# EAGLE design MJ808 clone - all driver - prod - 23mm (EAGLE 9.4.0)
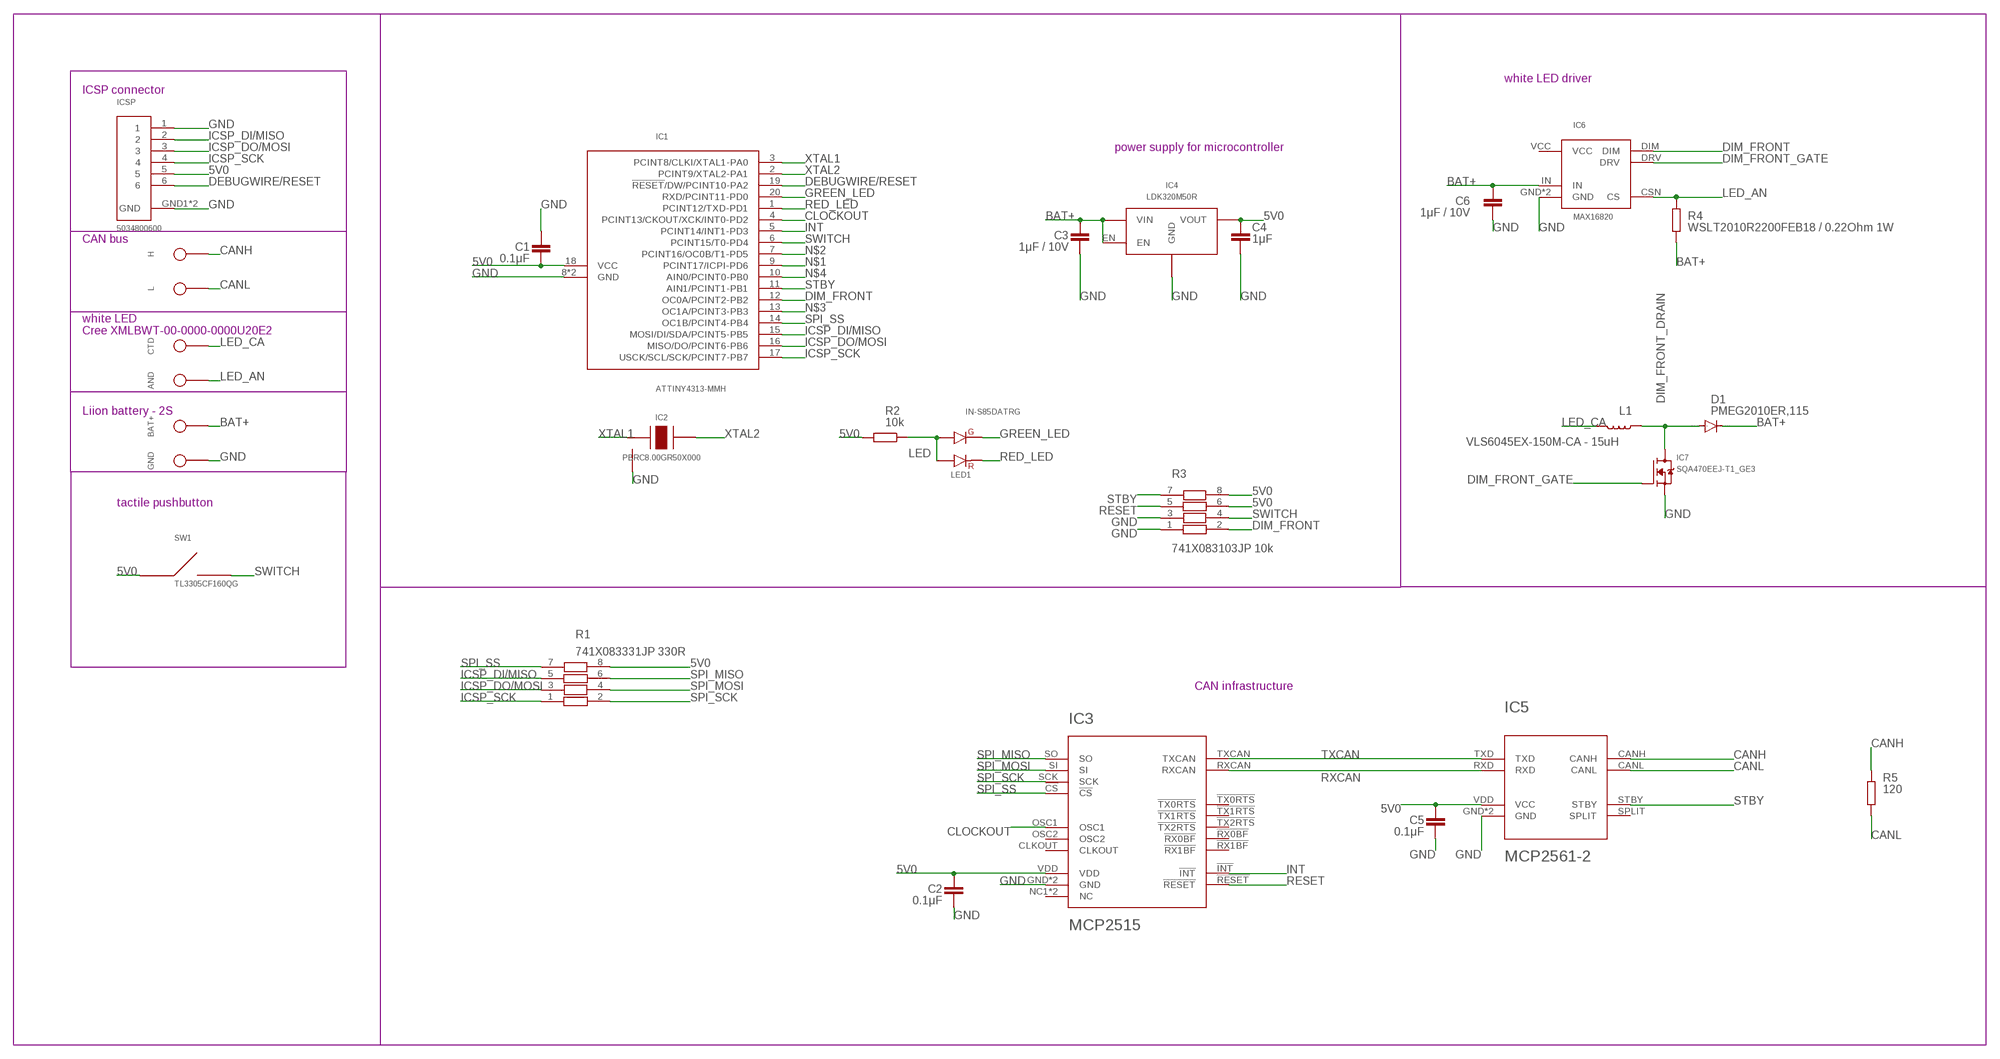
[diagram p0: schematic, sheet 1]

## Parts
AND  LED anode  TPTH-0.9MM  [TH-0.9MM]
BAT+  LiIon + Terminal  TPTH-0.9MM  [TH-0.9MM]
C1  0.1μF  C-EUC0402  [C0402]
C2  0.1μF  C-EUC0402  [C0402]
C3  1μF / 10V  C-EUC0402  [C0402]
C4  1μF  C-EUC0402  [C0402]
C5  0.1μF  C-EUC0402  [C0402]
C6  1μF / 10V  C-EUC0402  [C0402]
CTD  LED cathode  TPTH-0.9MM  [TH-0.9MM]
D1  PMEG2010ER,115  DIODE-SOD123  [SOD123]
GND  LiIon - Terminal  TPTH-0.9MM  [TH-0.9MM]
H  CAN high  TPSMT-1.2MM  [SMT-1.2MM]
IC1  ATTINY4313-MMH  ATTINY4313VQFN-20  [VQFN-20]
IC2  PBRC8.00GR50X000  PRQV  [SMT]
IC3  MCP2515  MCP2515-I-ML  [QFN20]
IC4  LDK320M50R  LDK320SOT-23-5L  [SOT-23-5L]
IC5  MCP2561-2  [DFN10]
IC6  MAX16820  [TDFN-6-EP]
IC7  SQA470EEJ-T1_GE3  SIA456DJ  [SC-70-6]
ICSP  5034800600  5034800600  [SMT]
L  CAN low  TPSMT-1.2MM  [SMT-1.2MM]
L1  VLS6045EX-150M-CA - 15uH  INDUCTOR-SRN6045-33UH  [SRN6045]
LED1  IN-S85DATRG  APHBM2012LSURKZGKC  [SMD]
R1  741X083331JP 330R  741X083331JP  [0402-4R]
R2  10k  R-EU_R0402  [R0402]
R3  741X083103JP 10k  741X083331JP  [0402-4R]
R4  WSLT2010R2200FEB18 / 0.22Ohm 1W  R-EU_R2010  [R2010]
R5  120  R-EU_R0805  [R0805]
SW1  TL3305CF160QG  TL3305-844809  [SMD]

## Nets
5V0 [5v0]: C1.1 C2.1 C4.2 C5.1 IC1.18(VCC) IC3.VDD IC4.OUT(VOUT) IC5.VDD(VCC) ICSP.5 R1.8 R2.2 R3.6 R3.8 SW1.1 SW1.2
BAT+ [BAT+]: BAT+.TP$1 C3.1 C6.1 D1.C IC4.EN IC4.IN(VIN) IC6.IN R4.2
CANH [signal]: H.P$1(TP$1) IC5.CANH R5.2
CANL [signal]: IC5.CANL L.P$1(TP$1) R5.1
CLOCKOUT [signal]: IC1.4(PCINT13/CKOUT/XCK/INT0-PD2) IC3.OSC1
DEBUGWIRE/RESET [signal]: IC1.19(!RESET!/DW/PCINT10-PA2) ICSP.6
DIM_FRONT [signal]: IC1.12(OC0A/PCINT2-PB2) IC6.DIM R3.2
DIM_FRONT_DRAIN: D1.A IC7.1D(D) IC7.2D(D) IC7.5D(D) IC7.6D(D) IC7.D L1.1
DIM_FRONT_GATE [signal]: IC6.DRV IC7.3G(G)
GND: C1.2 C2.2 C3.2 C4.1 C5.2 C6.2 GND.TP$1 IC1.8(GND) IC1.GND IC2.GND IC3.GND IC3.GND6(GND) IC4.GND IC5.GND IC5.VSS(GND) IC6.GND IC6.GND1(GND) IC7.4S(S) IC7.S ICSP.1 ICSP.GND1(GND) ICSP.GND2(GND) R3.1 R3.3
GREEN_LED [signal]: IC1.20(RXD/PCINT11-PD0) LED1.3
ICSP_DI/MISO [signal]: IC1.15(MOSI/DI/SDA/PCINT5-PB5) ICSP.2 R1.5
ICSP_DO/MOSI [signal]: IC1.16(MISO/DO/PCINT6-PB6) ICSP.3 R1.3
ICSP_SCK [signal]: IC1.17(USCK/SCL/SCK/PCINT7-PB7) ICSP.4 R1.1
INT [signal]: IC1.5(PCINT14/INT1-PD3) IC3.!INT!
LED [signal]: LED1.1 LED1.4 R2.1
LED_AN: AND.TP$1 IC6.CSN(CS) R4.1
LED_CA: CTD.TP$1 L1.2
N$1: IC1.9(PCINT17/ICPI-PD6)
N$2: IC1.7(PCINT16/OC0B/T1-PD5)
N$3: IC1.13(OC1A/PCINT3-PB3)
N$4: IC1.10(AIN0/PCINT0-PB0)
RED_LED [signal]: IC1.1(PCINT12/TXD-PD1) LED1.2
RESET [signal]: IC3.!RESET! R3.5
RXCAN: IC3.RXCAN IC5.RXD
SPI_MISO [signal]: IC3.SO R1.6
SPI_MOSI: IC3.SI R1.4
SPI_SCK: IC3.SCK R1.2
SPI_SS [signal]: IC1.14(OC1B/PCINT4-PB4) IC3.!CS! R1.7
STBY [signal]: IC1.11(AIN1/PCINT1-PB1) IC5.STBY R3.7
SWITCH [signal]: IC1.6(PCINT15/T0-PD4) R3.4 SW1.3 SW1.4
TXCAN: IC3.TXCAN IC5.TXD
XTAL1 [signal]: IC1.3(PCINT8/CLKI/XTAL1-PA0) IC2.XTAL1
XTAL2 [signal]: IC1.2(PCINT9/XTAL2-PA1) IC2.XTAL2
Unconnected: IC3.!RX0BF! IC3.!RX1BF! IC3.!TX0RTS! IC3.!TX1RTS! IC3.!TX2RTS! IC3.CLKOUT IC3.NC1(NC) IC3.NC2(NC) IC3.OSC2 IC5.SPLIT

## Notes on the sheet
- white LED driver
- ICSP connector
- power supply for microcontroller
- CAN bus
- white LED
  Cree XMLBWT-00-0000-0000U20E2
- Liion battery - 2S
- tactile pushbutton
- CAN infrastructure

## Power pins joined to a net without a drawn wire
VCC: IC6.VCC

## Library data of the parts
AND BAT+ CTD GND H L = signal testpoint:TP
C1-C6 = rcl:C-EU: CAPACITOR, European symbol; SPICEPREFIX: C
D1 = diode:DIODE-: DIODE
IC1 = ATtiny4313 microcontroller:ATTINY4313; SPICEPREFIX: X
IC2 = PRQV8.00CR1510Y00L - 8MHz resonator:PRQV
IC3 = MCP2515-I-ML - Standalonce CAN Controller with SPI Interface:MCP2515-I-ML
IC4 = LDK320 5V LDO:LDK320
IC5 = MCP2561-2 - High-Speed CAN Transceiver:MCP2561-2
IC6 = MAX16820 LED Driver, constant current:MAX16820
IC7 = SIA456DJ-T1-GE3  N-Fet:SIA456DJ
ICSP = 5034800600 FPC Connector:5034800600
L1 = SparkFun-Coils:INDUCTOR: Inductors Resist changes in electrical current. Basically a coil of wire. SparkFun Products: SparkFun Load Cell Amplifier - HX711 <https://www.sparkfun.com/products/13879> IOIO-OTG - V2.2 <https://www.sparkfun.com/products/13613>; PROD_ID: NDUC-11627; VALUE: 33µH/±20%/1.4A
LED1 = APHBM2012LSURKZGKC:APHBM2012LSURKZGKC
R1 R3 = 74x-1133528 Resistor Array:741X083331JP
R2 R4 R5 = rcl:R-EU_: RESISTOR, European symbol; SPICEPREFIX: R
SW1 = TL3305-844809 SPST-NO Tact Switch:TL3305-844809

## Net classes
0 GND: width 0.25 mm, drill 0.35 mm, clearance 0.2 mm
1 BAT+: width 0.5 mm, drill 0.35 mm, clearance 0.2 mm
2 5v0: width 0.3 mm, drill 0.35 mm, clearance 0.2 mm
3 signal: width 0.25 mm, drill 0.35 mm, clearance 0.2 mm

## Board
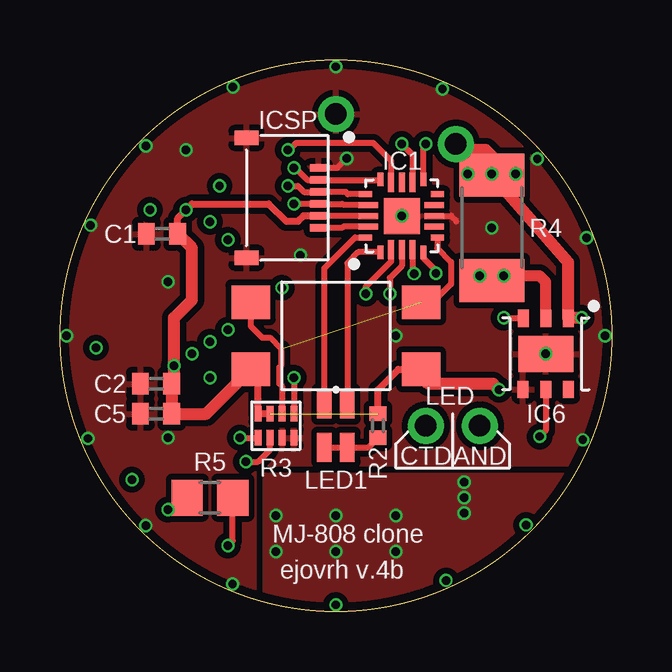
[diagram p1: board, top side]
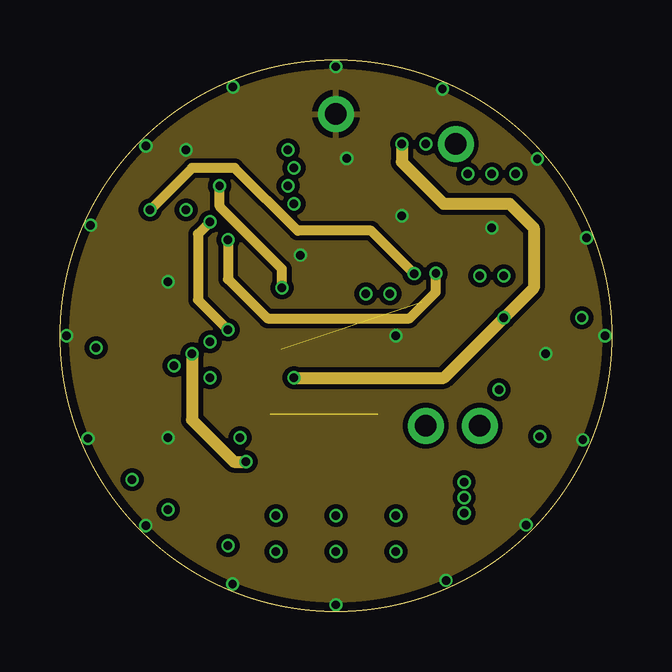
[diagram p2: board, inner layer Route2]
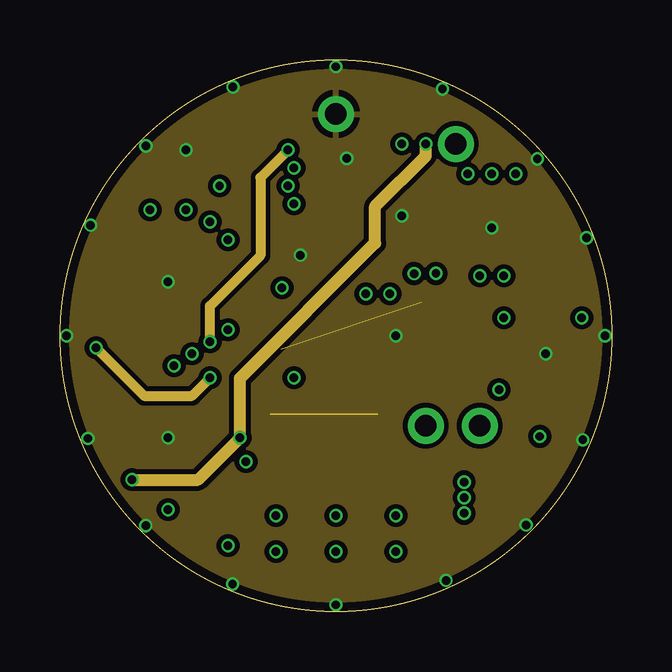
[diagram p3: board, inner layer Route15]
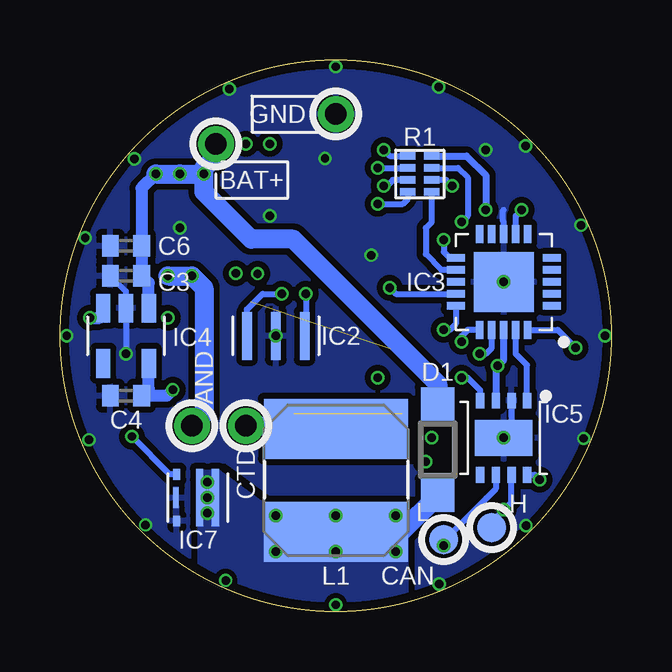
[diagram p4: board, bottom side, seen from below]

Size 23 x 23 mm. Coordinates in mm from the lower left corner, seen from the top.
Outline: circle at 11.5,11.5 radius 11.5
Copper layers (1*2*15*16): Top 0.035559375mm / dielectric 0.17018125mm / Route2 0.01778125mm / dielectric 47mil / Route15 0.01778125mm / dielectric 0.17018125mm / Bottom 0.035559375mm
Design rules "oshpark-4layer *": minimum track width 5mil, minimum drill 10mil, track to track 5mil, track to pad 5mil, pad to pad 5mil, via to via 5mil, smd to smd 5mil, copper to edge 15mil, drill to drill 6mil, minimum pad ring 4mil, minimum via ring 4mil, stop-mask expansion 2.5mil, vias tented up to drill 0mil, thermal gap 10mil
bRestrict: area 3.5,7.1 to 5.5,7.4

### Footprints (pad centres in the part's own frame; a part is rotated, then mirrored left to right if it is on the bottom)
TH-0.9MM = drill 0.9 pad 1.5: TP$1 0,0
C0402 = smd 0.7 x 0.9: 1 -0.65,0; 2 0.65,0
SOD123 = smd 1.4 x 1.4: A 1.9,0; C -1.9,0
SMT-1.2MM = smd 1.2 x 1.2: P$1 0,0
VQFN-20 = smd 0.55 x 0.25: 1 -1.52,0.9; 5 -1.52,-0.9; 11 1.52,-0.9; 15 1.52,0.9 | smd 0.8 x 0.25: 2 -1.4,0.45; 3 -1.4,0; 4 -1.4,-0.45; 12 1.4,-0.45; 13 1.4,0; 14 1.4,0.45 | smd 0.25 x 0.55: 6 -0.9,-1.48; 10 0.9,-1.48; 16 0.9,1.52; 20 -0.9,1.52 | smd 0.25 x 0.8: 7 -0.45,-1.35; 8 0,-1.35; 9 0.45,-1.35; 17 0.45,1.4; 18 0,1.4; 19 -0.45,1.4 | smd 1.5 x 1.5: GND 0,0
SMT = smd 0.4 x 2: GND 0,0; XTAL1 -1.2,0; XTAL2 1.2,0
QFN20 = smd 0.3 x 0.75: !CS! 1,2; !RESET! 0.5,2; !RX0BF! 1,-2; !RX1BF! 0.5,-2; GND6 0,-2; OSC1 -0.5,-2; OSC2 -1,-2; RXCAN -1,2; TXCAN -0.5,2; VDD 0,2 | smd 0.75 x 0.3: !INT! 2,-1; !TX0RTS! -2,0.5; !TX1RTS! -2,0; !TX2RTS! -2,-1; CLKOUT -2,1; NC1 -2,-0.5; NC2 2,0; SCK 2,-0.5; SI 2,0.5; SO 2,1 | smd 2.5 x 2.5: GND 0,0
SOT-23-5L = smd 0.6 x 1.2: ADJ/NC -0.95,-1.15; EN -0.95,1.15; GND 0,1.15; IN 0.95,1.15; OUT 0.95,-1.15
DFN10 = smd 0.35 x 0.65: CANH -0.325,1.55; CANL 0.325,1.55; RXD 0.975,-1.55; SPLIT 0.975,1.55; STBY -0.975,1.55; TXD -0.975,-1.55; VDD 0.325,-1.55; VSS -0.325,-1.55 | smd 2.4 x 1.5: GND 0,0
TDFN-6-EP = smd 0.71 x 0.46: CSN -1.48,0; DIM -1.48,-0.94; DRV 1.48,0; GND1 1.48,-0.95; IN -1.48,0.94; VCC 1.48,0.95 | smd 1.5 x 2.3: GND 0,0
SC-70-6 = smd 0.45 x 0.3: 1D -0.975,0.725; 2D -0.975,0.075; 3G -0.975,-0.88; 4S 0.975,-0.88; 5D 0.975,0.075; 6D 0.975,0.725 | smd 1.5 x 0.95: D 0,0.4 | smd 0.87 x 0.23: S 0,-0.915
SMT' = smd 0.3 x 0.7: 1 -1.25,1.27; 2 -0.75,1.27; 3 -0.25,1.27; 4 0.25,1.27; 5 0.75,1.27; 6 1.25,1.27 | smd 0.6 x 1: GND1 -2.5,-1.73; GND2 2.5,-1.73
SRN6045 = smd 2.5 x 6: 1 -2.175,0; 2 2.125,0
SMD = smd 1.2 x 0.6: 1 0.9,0.48; 2 -0.9,0.48; 3 -0.9,-0.48; 4 0.9,-0.48
0402-4R = smd 0.65 x 0.3: 1 -0.5,-0.75; 2 0.5,-0.75; 3 -0.5,-0.25; 4 0.5,-0.25; 5 -0.5,0.25; 6 0.5,0.25; 7 -0.5,0.75; 8 0.5,0.75
R0402 = smd 0.6 x 0.7: 1 -0.5,0; 2 0.5,0
R2010 = smd 1.8 x 2.7: 1 -2.2,0; 2 2.2,0
R0805 = smd 1.3 x 1.5: 1 -0.95,0; 2 0.95,0
SMD' = smd 1.6 x 1.4: 1 -3.556,-1.397; 2 3.556,-1.397; 3 -3.556,1.397; 4 3.556,1.397

### Placement (x,y rotation side)
AND  17.5,7.75 0 bottom
BAT+  16.5,19.5 0 bottom
C1  4.25,15.75 180 top
C2  4,9.5 180 top
C3  20.25,14 180 bottom
C4  20.25,9 0 bottom
C5  4,8.25 180 top
C6  20.25,15.25 180 bottom
CTD  15.25,7.75 0 bottom
D1  7.25,6.75 270 bottom
GND  11.5,20.75 0 bottom
H  5,3.5 0 bottom
IC1  14.25,16.5 90 top
IC2  14,11.5 0 bottom
IC3  4.5,13.75 180 bottom
IC4  20.25,11.5 0 bottom
IC5  4.5,7.25 180 bottom
IC6  20.25,10.75 270 top
IC7  17.25,4.75 270 bottom
ICSP  5034800600  [SMT']  9.5,17.25 270 top
L  7,3 0 bottom
L1  11.5,5.5 90 bottom
LED1  11.5,7.75 270 top
R1  8,18.25 0 bottom
R2  13.25,7.75 90 top
R3  9,7.75 90 top
R4  18,16 90 top
R5  6.25,4.75 180 top
SW1  TL3305CF160QG  [SMD']  11.5,11.5 0 top

### Tracks (layer width: path | path; a pad name or v marks a point on that pad's centre or on a via)
5V0  (via drill 0.35)  (1 unrouted)
  Top 0.254: IC1.18 ICSP.5
  Top 0.3: ICSP.5 10.15,16.5 9.92,16.27 9.43,16.27 8.7,17 5.5,17 v5.25,16.75 4.9,16.4 C1.1 | R3.6 R3.8 8.25,9.8 SW1.1 | R2.2 13.25,9.25 14.1,10.1 SW1.2
  Top 0.508: v18.3,9.25 18.05,9.5 15.36,9.5 15.06,9.8 SW1.2 15.06,10.06 | SW1.1 6.09,8.25 C5.1 C2.1 4.75,9.6 v4.75,10.25 4.75,12.25 5.5,13 5.5,15.15 C1.1
  Bottom 0.3: R1.8 6.05,19 5.25,18.2 v5.25,16.75 | IC3.VDD 4.5,10.5 v4.75,10.25 4.83,10.18 IC5.VDD
  Bottom 0.5: 19.3,9.3 IC4.OUT | v18.3,9.25 18.55,9 C4.2
  Bottom 0.508: C4.2 19.3,9.3
BAT+  (via drill 0.35)
  Top 0.5: v18,18.25 R4.2 21.19,14.55 IC6.IN 21.73,12.23 v21.75,12.25
  Top 0.508: BAT+.TP$1 16.75,19.25 17.75,19.25 18,19 v18,18.25
  Bottom 0.5: v19,18.25 19.6,17.65 C6.1 C3.1 19.3,13.7 IC4.IN | IC4.EN 21.2,12.4 21.35,12.25 v21.75,12.25
  Bottom 0.8: v19,18.25 v18,18.25 v17,18.25 | v17,18.25 17,18.5 16.5,19 BAT+.TP$1 | D1.C 7.25,9.5 13.28,15.53 15.03,15.53 17,17.5 v17,18.25
CANH  (via drill 0.35)
  Top 0.254: v4.5,4.25 5,4.75 R5.2
  Bottom 0.254: IC5.CANH 4.17,4.58 v4.5,4.25 5,3.75 H.P$1
CANL  (via drill 0.35)
  Top 0.254: v7,2.75 7.2,2.95 R5.1
  Bottom 0.25: IC5.CANL 4.83,5.12 5.22,4.72
  Bottom 0.254: 5.22,4.72 7,2.95 v7,2.75 L.P$1
CLOCKOUT  (via drill 0.35)
  Top 0.25: v14.76,14.09 14.7,14.15 IC1.4
  Route2 0.406: v14.76,14.09 12.97,15.88 9.9,15.88 7.28,18.5 5.5,18.5 v3.75,16.75
  Bottom 0.254: IC3.OSC1 4,16.5 v3.75,16.75
DEBUGWIRE/RESET
  Top 0.254: ICSP.6 11.75,16 11.8,16.05 IC1.19
DIM_FRONT  (via drill 0.35)
  Top 0.254: IC1.12 14.7,19.05 v14.25,19.5 | v18.5,12.25 19.29,12.25 IC6.DIM | v9.75,9.75 R3.2
  Route2 0.508: v14.25,19.5 14.25,18.75 16,17 18.75,17 19.75,16 19.75,13.5 v18.5,12.25 16,9.75 v9.75,9.75
DIM_FRONT_DRAIN  (via drill 0.35)
  Bottom 0.254: IC7.1D 16.52,5.65 | IC7.D 17.18,4.75 IC7.2D
  Bottom 0.8: 8.78,3.32 D1.A
  other vias: 16.85,4.75 16.85,4.1 16.85,5.4 14,4 14,2.5 11.5,2.5 11.5,4 9,4 9,2.5
  pour Top (isolate 0.254, no thermals): 8.5,5.75 22,5.75 22,-0.62 8.5,-0.62
  pour Bottom (no thermals): 8.5,-0.25 8.5,4.5 14.5,4.5 16.38,5.88 17.25,5.88 17.25,-0.25
DIM_FRONT_GATE  (via drill 0.35)
  Top 0.254: IC6.DRV 20.25,7.55 v20,7.3
  Bottom 0.254: IC7.3G 18.43,5.72 v20,7.3
GND  (via drill 0.35)
  Top 0.254: v11.95,18.9 11.55,18.5 ICSP.1 | IC1.8 16.3,16.5 16.32,16.48 16.32,16.46 16.52,16.27
  Bottom 0.25: IC5.VSS 4.17,7.58
  Bottom 0.254: 4.17,7.58 IC5.GND | C3.2 20.25,13.35 IC4.GND IC6.GND | IC3.GND6 4.5,16.25 4.53,16.28 4.53,16.72 4.5,16.75
  other vias: 5.25,19.25 22.72,11.5 14,11.5 0.27,11.5 11.5,22.72 11.5,0.28 19.43,3.61 3.57,3.58 3.58,19.42 19.9,18.87 7.21,21.87 15.94,21.79 21.95,15.58 21.8,7.16 16.09,1.3 7.19,1.15 4.5,7.25 1.27,16.11 10.02,14.86 14.25,16.5 4.5,13.75 20.25,10.75 18,16 1.16,7.22
  pour Route2: -0.5,23.5 23.5,23.5 23.5,-0.75 -0.5,-0.75
  pour Route15: -0.5,23.5 23.5,23.5 23.5,-0.5 -0.5,-0.5
  pour Top (isolate 0.254, rank 2): -0.5,23.5 23.5,23.5 23.5,-1.25 -0.5,-1.25
  pour Bottom (isolate 0.254, rank 2): -0.5,-0.75 23.5,-0.75 23.5,23.5 -0.5,23.5
GREEN_LED
  Top 0.25: LED1.3 11.02,14.32 12.3,15.6 IC1.20
ICSP_DI/MISO  (via drill 0.35)
  Top 0.25: v9.75,18.5 9.81,18.5 10.31,17.99 ICSP.2
  Top 0.254: IC1.15 13.33,18 ICSP.2
  Bottom 0.25: v9.75,18.5 R1.5
ICSP_DO/MOSI  (via drill 0.35)
  Top 0.25: v9.5,17.75 9.91,17.75 10.16,17.5 ICSP.3
  Top 0.254: ICSP.3 11.9,17.5 12,17.4 IC1.16
  Bottom 0.25: R1.3 9.12,18 9.37,17.75 v9.5,17.75
ICSP_SCK  (via drill 0.35)
  Top 0.25: IC1.17 11.82,16.95 11.77,17 ICSP.4 v9.75,17
  Bottom 0.25: R1.1 8.5,17.2 8.7,17 v9.75,17
INT  (via drill 0.35)
  Top 0.25: v15.67,14.1 15.67,14.21 15.15,14.73 IC1.5
  Route2 0.406: v15.67,14.1 15.67,13.32 14.57,12.22 8.64,12.22 7,13.86 v7,15.5
  Bottom 0.254: v7,15.5 7,15 6.75,14.75 IC3.!INT!
LED
  Top 0.25: LED1.4 LED1.1 12.85,6.85 R2.1
LED_AN  (via drill 0.35)
  Top 0.254: v18.5,14 18.2,14 R4.1
  Top 0.45: IC6.CSN 20.25,13.75 20,14 v18.5,14
  Bottom 0.8: v18.5,14 v17.5,14 17,13.5 17,8.25 AND.TP$1
LED_CA
  Bottom 0.8: L1.2 11.62,7.75 CTD.TP$1
RED_LED
  Top 0.25: IC1.1 12.43,14.98 11.98,14.53 LED1.2
RESET  (via drill 0.35)
  Top 0.25: v7.75,6.25 8.25,6.25 8.75,6.75 R3.5
  Route2 0.508: v5.5,10.75 5.5,8 7.25,6.25 v7.75,6.25
  Bottom 0.25: v5.5,10.75 5.25,10.75 5,11 IC3.!RESET!
RXCAN  (via drill 0.35)
  Route15 0.406: v1.5,11 3.5,9 5.5,9 v6.25,9.75
  Bottom 0.25: IC5.RXD 5.47,9.22 6,9.75 v6.25,9.75 | IC3.RXCAN 2.25,11.75 v1.5,11
SPI_MISO  (via drill 0.35)
  Route2 0.406: v6.25,16.25 5.75,15.75 5.75,13 v7,11.75
  Bottom 0.25: R1.6 6.4,18.5 6,18.1 6,16.5 | v7,11.75 6.75,11.75 6.5,12 IC3.SO
  Bottom 0.254: 6,16.5 v6.25,16.25
SPI_MOSI  (via drill 0.35)
  Route2 0.406: v9.25,13.5 9.25,14.29 6.65,16.89 v6.65,17.75
  Bottom 0.25: v6.65,17.75 6.9,18 R1.4
  Bottom 0.254: v9.25,13.5 9,13.25 IC3.SI
SPI_SCK
  Bottom 0.254: IC3.SCK 7.1,14.25 7.75,14.9 7.75,16 7.5,16.25 R1.2
SPI_SS  (via drill 0.35)
  Top 0.25: IC1.14 13.8,18.8 13.05,19.55 9.85,19.55
  Top 0.254: v9.5,19.25 9.55,19.25 9.85,19.55
  Route15 0.406: v9.5,19.25 8.35,18.1 8.35,14.85 6.25,12.75 v6.25,11.25
  Bottom 0.25: v9.5,19.25 9.25,19 R1.7 | IC3.!CS! 6,11.75 6.25,11.5 v6.25,11.25
STBY  (via drill 0.35)
  Top 0.25: 15.15,19.4 v15.25,19.5
  Top 0.254: IC1.11 15.15,19.4 | v7.5,7.25 R3.7
  Route15 0.508: v3,5.5 5.75,5.5 v7.5,7.25 7.5,9.72 13.14,15.36 13.14,16.89 15.25,19 v15.25,19.5
  Bottom 0.254: IC5.STBY 3.2,5.7 v3,5.5
SWITCH  (1 unrouted)
  Top 0.25: IC1.6 15.73,15.15 16.3,14.58 16.3,13.65 15.55,12.9 SW1.4 | SW1.3 7.94,11.9 8.42,11.42 8.75,11.42 9.22,10.95 9.22,10.25 9.15,10.18 9.15,9.5 9.25,9.4 R3.4
TXCAN
  Bottom 0.25: IC5.TXD 3.53,10.28 4,10.75 IC3.TXCAN
XTAL1  (via drill 0.35)
  Top 0.25: IC1.3 14.25,14.41 13.75,13.91 v13.75,13.25
  Bottom 0.254: v13.75,13.25 14.55,13.25 15.2,12.6 IC2.XTAL1
XTAL2  (via drill 0.35)
  Top 0.25: v12.75,13.25 12.75,13.55 13.8,14.6 IC1.2
  Bottom 0.254: IC2.XTAL2 12.75,11.55 v12.75,13.25

### Text on the board
tPlace: LED | MJ-808 clone | ejovrh v.4b
bNames: AND | CTD | CAN